# EAGLE design nGeigie_upper_boardV1.00 (EAGLE 7.2.0)
DESIGNER: Rob Oudendijk; VERSION: V1.00
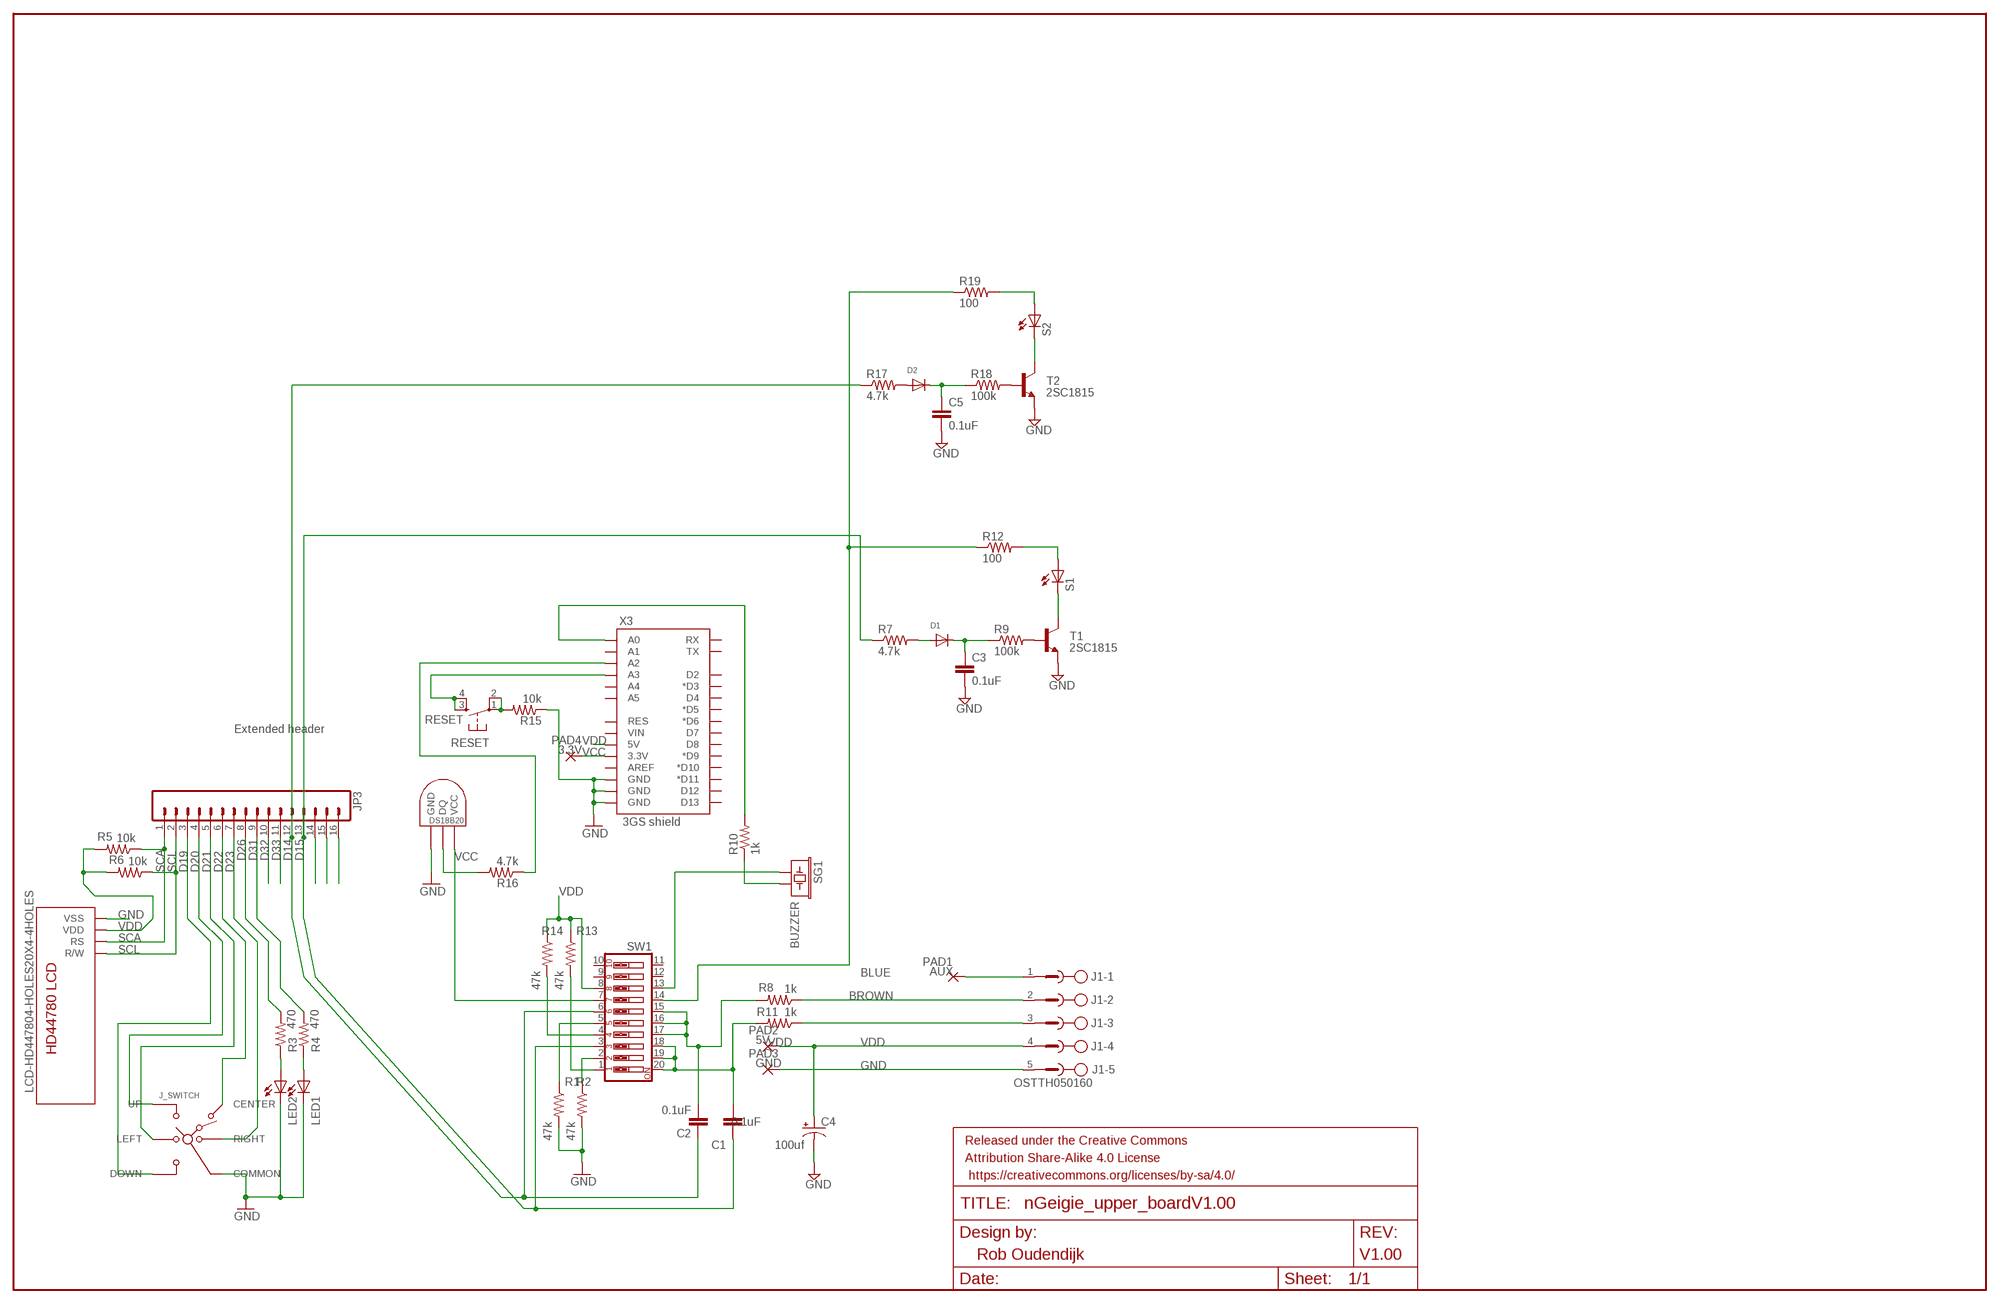
[diagram p0: schematic, sheet 1]

## Parts
C1  0.1uF  C-EU025-024X044  [C025-024X044]
C2  0.1uF  C-EU025-024X044  [C025-024X044]
C3  0.1uF  C-EU025-024X044  [C025-024X044]
C4  100uf  CAP_POLPTH1  [CPOL-RADIAL-100UF-25V]
C5  0.1uF  C-EU025-024X044  [C025-024X044]
D1  DIODEDIODE_BIG  [DO41-10]
D2  DIODEDIODE_BIG  [DO41-10]
FRAME1  FRAME-LEDGER  [CREATIVE_COMMONS]
J1  OSTTH050160  [EDSTL130-05]
J_SWITCH  SKQUCAA010  [SKQU]
JP3  Extended header  M16PTH  [1X16]
LED1  LED3MM  [LED3MM]
LED2  LED3MM  [LED3MM]
PAD1  AUX  2,15/1,0  [2,15/1,0]
PAD2  5V  2,15/1,0  [2,15/1,0]
PAD3  GND  2,15/1,0  [2,15/1,0]
PAD4  3.3V  2,15/1,0  [2,15/1,0]
R1  47k  R-US_0207/10  [0207/10]
R2  47k  R-US_0207/10  [0207/10]
R3  470  R-US_0207/10  [0207/10]
R4  470  R-US_0207/10  [0207/10]
R5  10k  R-US_0207/10  [0207/10]
R6  10k  R-US_0207/10  [0207/10]
R7  4.7k  R-US_0207/10  [0207/10]
R8  1k  R-US_0207/10  [0207/10]
R9  100k  R-US_0207/10  [0207/10]
R10  1k  R-US_0207/10  [0207/10]
R11  1k  R-US_0207/10  [0207/10]
R12  100  R-US_0207/10  [0207/10]
R13  47k  R-US_0207/10  [0207/10]
R14  47k  R-US_0207/10  [0207/10]
R15  10k  R-US_0207/10  [0207/10]
R16  4.7k  R-US_0207/10  [0207/10]
R17  4.7k  R-US_0207/10  [0207/10]
R18  100k  R-US_0207/10  [0207/10]
R19  100  R-US_0207/10  [0207/10]
RESET  RESET  DTS-6  [DTS-6]
S1  LED3MM  [LED3MM]
S2  LED3MM  [LED3MM]
SG1  BUZZER  BUZZERPTH  [BUZZER-12MM]
SW1  SW_DIP-10  [EDG-10]
T1  2SC1815  [TO92-ECB]
T2  2SC1815  [TO92-ECB]
TEMP  AVA_DS1820TO92  [AVA_DS1820]
X1  LCD-HD447804-HOLES20X4-4HOLES  [LCD-20X4-4HOLES]
X3  3GS shield  ARDUINO_SHIELDLABEL  [DUEMILANOVE_SHIELD]

## Nets
BLUE: J1.2 R8.1
BROWN: J1.3 R11.1
D14: C2.1 JP3.12 R17.1 SW1.6
D15: C1.1 JP3.13 R7.1 SW1.3
D19: J_SWITCH.DOWN JP3.3
D20: J_SWITCH.UP JP3.4
D21: J_SWITCH.LEFT JP3.5
D22: J_SWITCH.CENTER JP3.6
D23: J_SWITCH.RIGHT JP3.7
D26: JP3.8 R3.2
D31: JP3.9 R4.2
D32: JP3.10
D33: JP3.11
GND [PWP]: C3.2 C4.1(-) C5.2 J1.5 J_SWITCH.COMMON LED1.K(C) LED2.K(C) PAD3.1(P) R1.2 R2.2 R15.1 T1.E T2.E TEMP.GND X1.P$13(VSS) X3.GND@0(GND) X3.GND@1(GND) X3.GND@2(GND)
N$1: SG1.+ SW1.13
N$2: JP3.14
N$3: LED2.A R3.1
N$4: JP3.15
N$5: R10.2 X3.A0
N$6: R14.2 SW1.4
N$7: R12.1 R19.1 SW1.14
N$8: R2.1 SW1.2
N$9: R1.1 SW1.5
N$10: J1.1 PAD1.1(P)
N$23: R10.1 SG1.-
N$24: R16.2 TEMP.DQ
N$39: C1.2 R11.2 SW1.18 SW1.19 SW1.20
N$40: R16.1 X3.A2
N$43: R13.2 SW1.1
N$54: D1.A R7.2
N$58: C3.1 D1.C R9.1
N$62: LED1.A R4.1
N$76: R9.2 T1.B
N$77: S1.K(C) T1.C
N$84: R15.2 RESET.1 RESET.2
N$85: RESET.3 RESET.4 X3.A3
N$92: R12.2 S1.A
N$136: D2.A R17.2
N$137: C5.1 D2.C R18.1
N$138: R18.2 T2.B
N$139: S2.K(C) T2.C
N$140: R19.2 S2.A
N$223: C2.2 R8.2 SW1.15 SW1.16 SW1.17
N$244: JP3.16
SCA: JP3.1 R5.1 X1.P$15(RS)
SCL: JP3.2 R6.1 X1.P$16(R/W)
VCC [PWP]: PAD4.1(P) SW1.7 TEMP.VDD(VCC) X3.3.3V
VDD [PWP]: C4.2(+) J1.4 PAD2.1(P) R5.2 R6.2 R13.1 R14.1 SW1.8 X1.P$14(VDD) X3.5V
Unconnected: SW1.9 SW1.10 SW1.11 SW1.12 X3.A1 X3.A4 X3.A5 X3.AREF X3.D2 X3.D3(*D3) X3.D4 X3.D5(*D5) X3.D6(*D6) X3.D7 X3.D8 X3.D9(*D9) X3.D10(*D10) X3.D11(*D11) X3.D12 X3.D13 X3.RES X3.RX X3.TX X3.VIN

## Library data of the parts
C1-C3 C5 = rcl:C-EU: CAPACITOR, European symbol
C4 = SparkFun-Capacitors:CAP_POL: Capacitor Polarized These are standard SMD and PTH capacitors. Normally 10uF, 47uF, and 100uF in electrolytic and tantalum varieties. Always verify the external diameter of the through hole cap, it varies with capacity, voltage, and manufacturer. The EIA devices should be standard.
D1 D2 = adafruit:DIODE: Diode SMADIODE - SMA Surface Mount Package 20V 1A Schottky Diode Digikey: 641-1014-6-ND DO-1N4148 - Through Hole Small Current Diode SOD-123 20V 1 A (.5mV Vf) Schottky Diode - Digikey: MBRX120TPMSCT-ND SOD-323 10V 570mA (.38mV Vf, 3ns) Schottky Diode - Digikey: ZLLS410CT-ND SOD-523 30V 30mA Schottky Diode (RB751S-40TE61) - Digikey: RB751S-40TE61CT-ND SOT23-R/W - SOT23 Package (R = Solder Paste/Reflow Ovens, W = Hand-Soldering) BAT54Film 40V 300mA - Digikey: 497-7162-1-ND
FRAME1 = SparkFun-Aesthetics:FRAME-LEDGER: Schematic Frame Standard 11x14 US Ledger frame
J1 = con-ost:OSTTH050160: 5mm Terminal Header
J_SWITCH = joy_switch:SKQU: Multi Control Devices TACT Switch - 4-directional with Center Push Type. SKQU Series.; MF: ALPS; OC_ADAFRUIT: 504; OC_MOUSER: 688-SKQUCA; OC_NEWARK: 59M1983
JP3 = SparkFun-Connectors:M16: 1x16 .1" header
LED1 LED2 S1 S2 = adafruit:LED: LED OSRAM: - CHIPLED LG R971, LG N971, LY N971, LG Q971, LY Q971, LO R971, LY R971 LH N974, LH R974 LS Q976, LO Q976, LY Q976 LO Q996 - Hyper CHIPLED LW Q18S LB Q993, LB Q99A, LB R99A - SideLED LS A670, LO A670, LY A670, LG A670, LP A670 LB A673, LV A673, LT A673, LW A673 LH A674 LY A675 LS A676, LA A676, LO A676, LY A676, LW A676 LS A679, LY A679, LG A679 - Hyper Micro SIDELED® LS Y876, LA Y876, LO Y876, LY Y876 LT Y87S - SmartLED LW L88C, LW L88S LB L89C, LB L89S, LG L890 LS L89K, LO L89K, LY L89K LS L896, LA L896, LO L896, LY L896 - TOPLED LS T670, LO T670, LY T670, LG T670, LP T670 LSG T670, LSP T670, LSY T670, LOP T670, LYG T670 LG T671, LOG T671, LSG T671 LB T673, LV T673, LT T673, LW T673 LH T674 LS T676, LA T676, LO T676, LY T676, LB T676, LH T676, LSB T676, LW T676 LB T67C, LV T67C, LT T67C, LS T67K, LO T67K, LY T67K, LW E67C LS E67B, LA E67B, LO E67B, LY E67B, LB E67C, LV E67C, LT E67C LW T67C LS T679, LY T679, LG T679 LS T770, LO T770, LY T770, LG T770, LP T770 LB T773, LV T773, LT T773, LW T773 LH T774 LS E675, LA E675, LY E675, LS T675 LS T776, LA T776, LO T776, LY T776, LB T776 LHGB T686 LT T68C, LB T68C - Hyper Mini TOPLED® LB M676 - Mini TOPLED Santana® LG M470 LS M47K, LO M47K, LY M47K Source: http://www.osram.convergy.de/
PAD1-PAD4 = wirepad:2,15/1,0: THROUGH-HOLE PAD
R1-R4 R8 R10 R11 R13-R16 = resistor:R-US_: RESISTOR, American symbol
R5 R6 = adafruit:R-US_: RESISTOR, American symbol
R7 R9 R12 R17-R19 = rcl:R-US_: RESISTOR, American symbol
RESET = switch-tact:DTS-6
SG1 = SparkFun:BUZZER: Buzzer 12mm Spark Fun Electronics SKU : Comp-Buzzer
SW1 = special:SW_DIP-10: DIP SWITCH
T1 T2 = transistor:2SC1815: NPN EPITAXIAL TRANSISTOR Source: TOSHIBA .. 2SC1815 1.pdf
TEMP = nGeigie_upper_boardTeensy 3Gshield upper board V0.98:AVA_DS1820: DS18B20 Programmable Resolution 1-Wire Digital Thermometer Description The DS18B20 digital thermometer provides 9-bit to 12-bit Celsius temperature measurements and has an alarm function with nonvolatile user-programmable upper and lower trigger points. The DS18B20 communicates over a 1-Wire® bus that by definition requires only one data line (and ground) for communication with a central microprocessor. It has an operating temperature range of -55°C to +125°C and is accurate to ±0.5°C over the range of -10°C to +85°C. In addition, the DS18B20 can derive power directly from the data line ("parasite power"), eliminating the need for an external power supply. Each DS18B20 has a unique 64-bit serial code, which allows multiple DS18B20s to function on the same 1-Wire bus. Thus, it is simple to use one microprocessor to control many DS18B20s distributed over a large area. Applications that can benefit from this feature include HVAC environmental controls, temperature monitoring systems inside buildings, equipment, or machinery, and process monitoring and control systems.
X1 = LCD204_I2C:LCD-HD44780
X3 = SparkFun-Boards:ARDUINO_SHIELD: Arduino shield footprint

## Net classes
0 default: width 0.406 mm, drill 0.254 mm, clearance 0.305 mm
1 PWP: width 0.813 mm, drill 0.254 mm, clearance 0.305 mm

## Board
nGeigie V2.0 Upper board V1.0.0
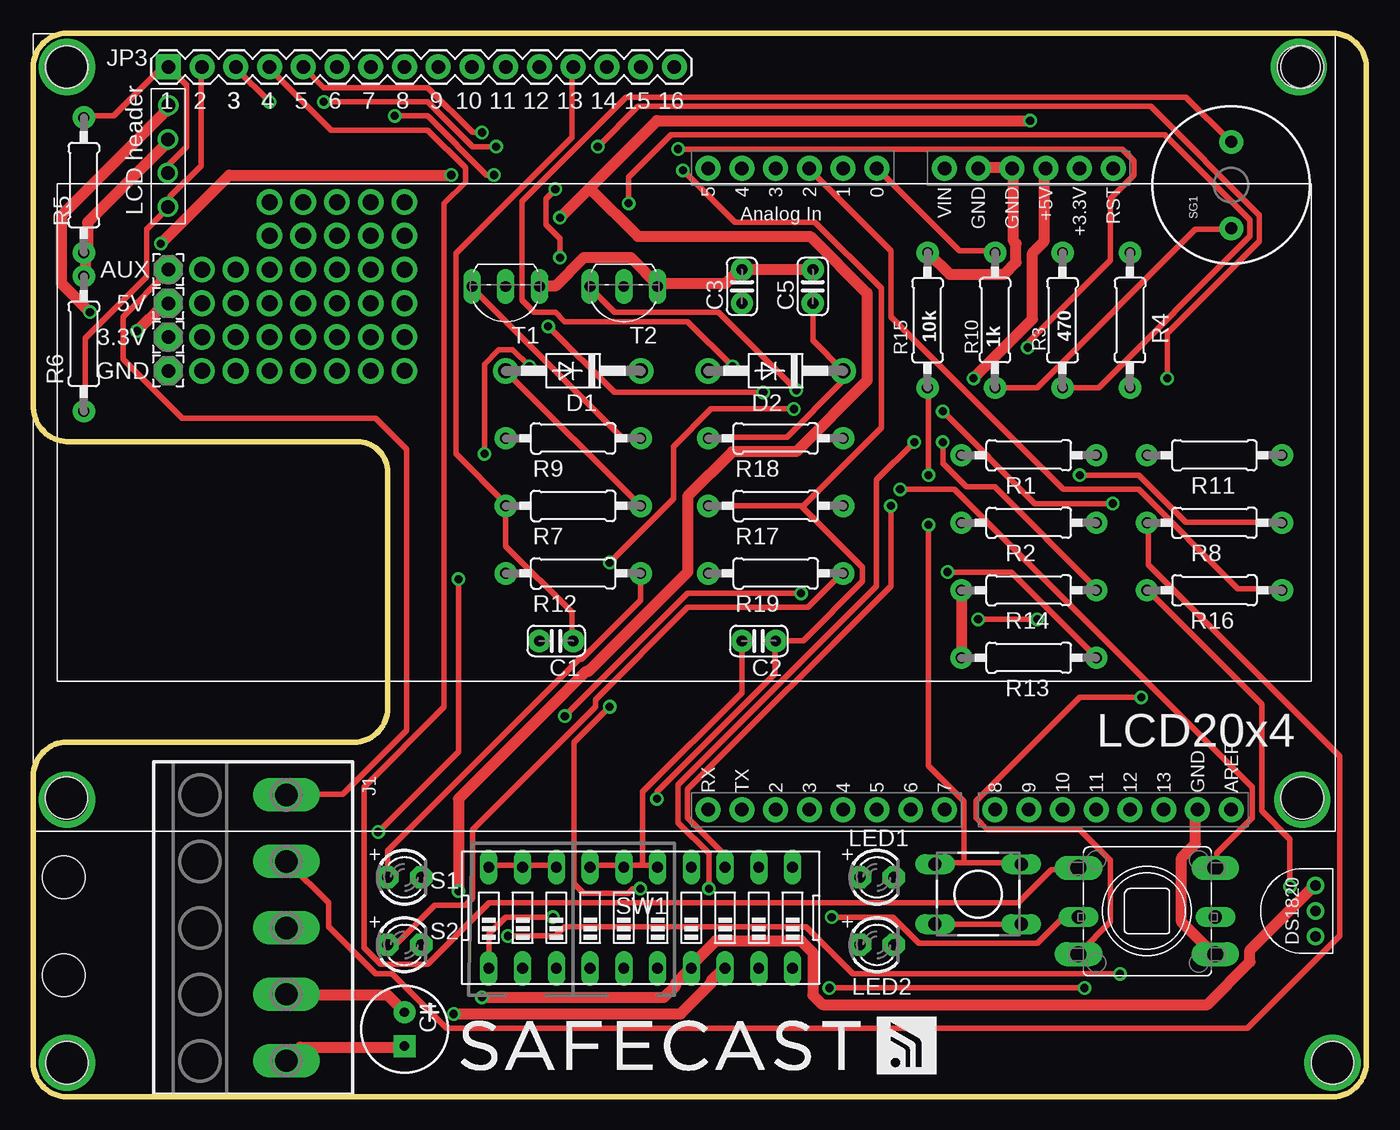
[diagram p1: board, top side]
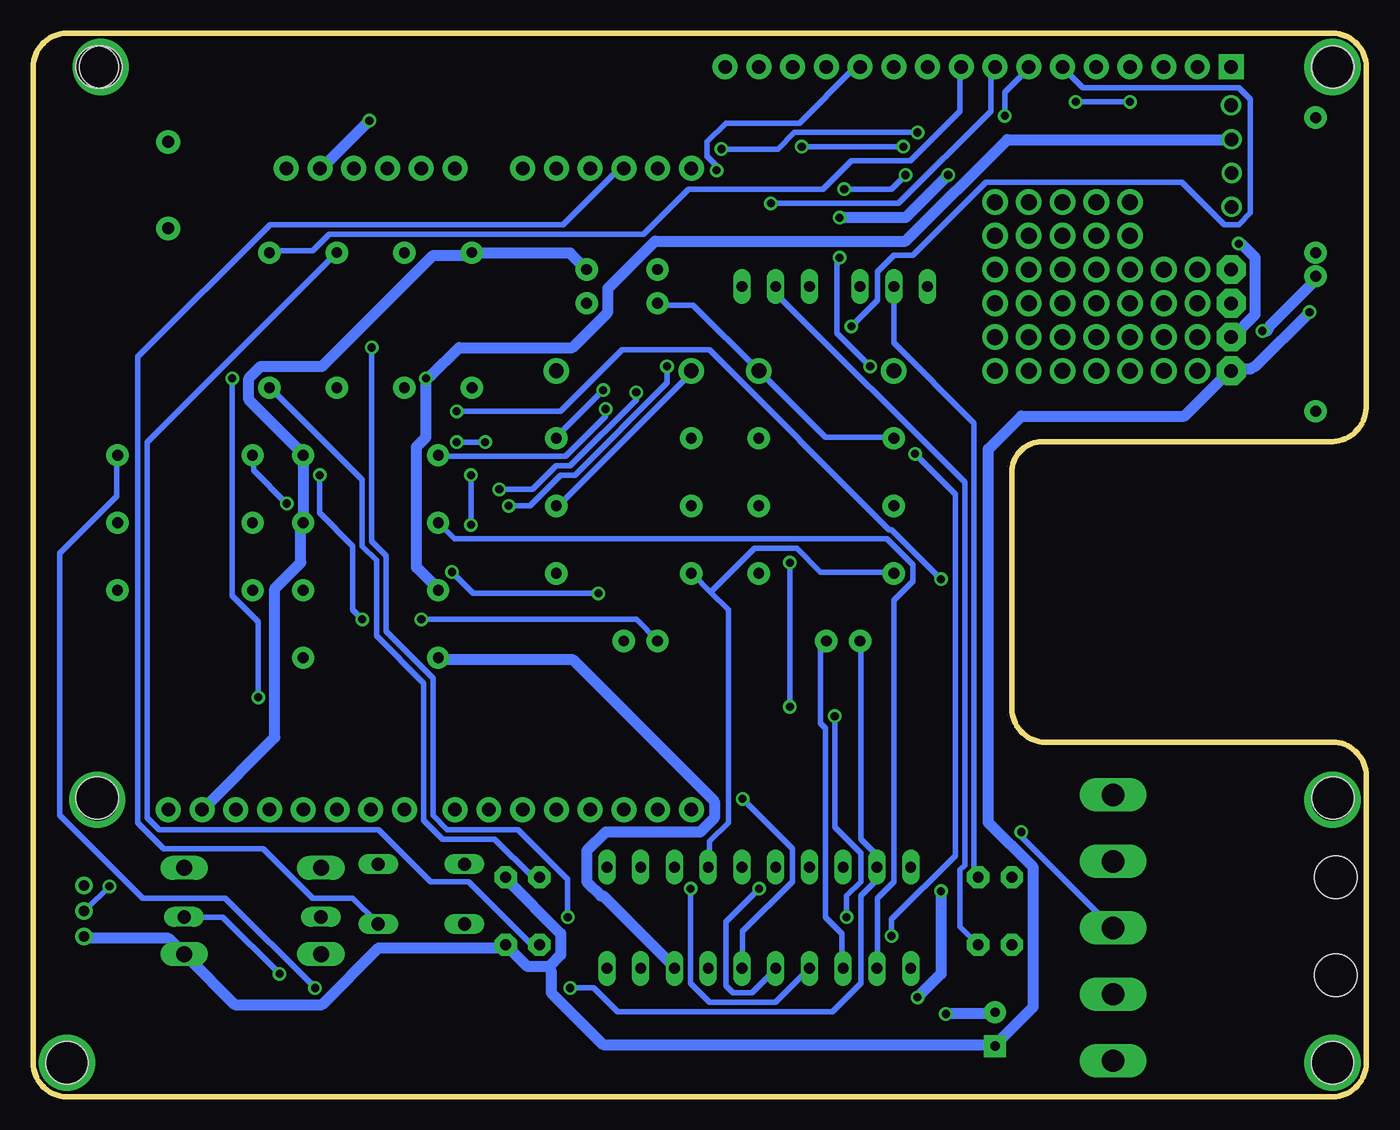
[diagram p2: board, bottom side, seen from below]

Size 100.33 x 80.01 mm. Coordinates in mm from the lower left corner, seen from the top.
Outline: 0,77.47 arc-90 2.54,80.01 97.79,80.01 arc-90 100.33,77.47 100.33,2.54 arc-90 97.79,0 2.54,0 arc-90 0,2.54 0,24.13 arc-90 2.54,26.67 24.13,26.67 arc90 26.67,29.21 26.67,46.99 arc90 24.38,49.28 2.54,49.28 arc-90 0,52.07 0,77.47
Copper layers (1*16): Top 0.035mm / dielectric 1.5mm / Bottom 0.035mm
Design rules "default": minimum track width 10mil, minimum drill 24mil, track to track 8mil, track to pad 8mil, pad to pad 8mil, via to via 8mil, smd to smd 8mil, copper to edge 40mil, drill to drill 8mil, minimum pad ring 10mil, minimum via ring 8mil, stop-mask expansion 4mil, vias tented up to drill 0mil, thermal gap 10mil
Holes 3.2 mm at 2.54,2.54 97.79,2.54 2.54,77.47 95.25,77.47 2.29,9.14 2.29,16.51 2.54,2.54

### Footprints (pad centres in the part's own frame; a part is rotated, then mirrored left to right if it is on the bottom)
C025-024X044 = drill 0.813 pad 1.676: 1 -1.27,0; 2 1.27,0
CPOL-RADIAL-100UF-25V = drill 0.7 pad 1.651 square: 1 -1.27,0 | drill 0.7 pad 1.651: 2 1.27,0
DO41-10 = drill 1.118 pad 1.93: A 5.08,0; C -5.08,0
EDSTL130-05 = drill 1.676 long: 1 -10,0; 2 -5,0; 3 0,0; 4 5,0; 5 10,0
SKQU = drill 1.2 long: CENTER 5.15,3.25; COMMON 5.15,-3.25; DOWN -5.15,-3.25; UP -5.15,3.25 | drill 1 long: LEFT -5.15,-0.45; RIGHT 5.15,-0.45
1X16 = drill 1.016 pad 1.88 square: 1 0,0 | drill 1.016 pad 1.88: 2 2.54,0; 3 5.08,0; 4 7.62,0; 5 10.16,0; 6 12.7,0; 7 15.24,0; 8 17.78,0; 9 20.32,0; 10 22.86,0; 11 25.4,0; 12 27.94,0; 13 30.48,0; 14 33.02,0; 15 35.56,0; 16 38.1,0
LED3MM = drill 0.813 pad 1.676 octagon: A -1.27,0; K 1.27,0
2,15/1,0 = drill 1.016 pad 2.159 octagon: 1 0,0
0207/10 = drill 0.8 pad 1.676: 1 -5.08,0 | drill 0.813 pad 1.676: 2 5.08,0
0207/10' = drill 0.813 pad 1.676: 1 -5.08,0; 2 5.08,0
DTS-6 = drill 1 long: 1 -3.25,2.25; 2 3.25,2.25; 3 -3.25,-2.25; 4 3.25,-2.25
BUZZER-12MM = drill 0.9 pad 1.778: + 3.25,0; - -3.25,0
EDG-10 = drill 0.813 long: 1 -11.43,-3.81; 2 -8.89,-3.81; 3 -6.35,-3.81; 4 -3.81,-3.81; 5 -1.27,-3.81; 6 1.27,-3.81; 7 3.81,-3.81; 8 6.35,-3.81; 9 8.89,-3.81; 10 11.43,-3.81; 11 11.43,3.81; 12 8.89,3.81; 13 6.35,3.81; 14 3.81,3.81; 15 1.27,3.81; 16 -1.27,3.81; 17 -3.81,3.81; 18 -6.35,3.81; 19 -8.89,3.81; 20 -11.43,3.81
TO92-ECB = drill 0.813 long: B 2.54,0; C 0,0; E -2.54,0
AVA_DS1820 = drill 0.8: DQ 2.54,-1.27; GND 0.635,-1.27; VDD 4.445,-1.27
LCD-20X4-4HOLES = drill 1.016: P$13 10.17,54.621; P$14 10.149,52.059; P$15 10.127,49.522; P$16 10.149,46.983 | hole 3.2: 2.5,2.5; 2.5,57.5; 95.5,57.5; 95.5,2.5
DUEMILANOVE_SHIELD = drill 1.016 pad 1.88: 3.3V 12.7,27.94; 5V 10.16,27.94; A0 -2.54,27.94; A1 -5.08,27.94; A2 -7.62,27.94; A3 -10.16,27.94; A4 -12.7,27.94; A5 -15.24,27.94; AREF 24.13,-20.32; D2 -10.16,-20.32; D3 -7.62,-20.32; D4 -5.08,-20.32; D5 -2.54,-20.32; D6 0,-20.32; D7 2.54,-20.32; D8 6.35,-20.32; D9 8.89,-20.32; D10 11.43,-20.32; D11 13.97,-20.32; D12 16.51,-20.32; D13 19.05,-20.32; GND@0 7.62,27.94; GND@1 5.08,27.94; GND@2 21.59,-20.32; RES 15.24,27.94; RX -15.24,-20.32; TX -12.7,-20.32; VIN 2.54,27.94

### Placement (x,y rotation side)
C1  39.37,34.29 180 top
C2  54.61,34.29 180 top
C3  53.34,60.96 90 top
C4  27.94,5.08 90 top
C5  58.67,60.96 90 top
D1  40.64,54.61 180 top
D2  55.88,54.61 180 top
FRAME1  69.85,-3.56 0 top  (outside the outline)
J1  19.05,12.7 270 top
J_SWITCH  83.82,13.97 0 top
JP3  10.16,77.47 0 top
LED1  63.5,16.51 0 top
LED2  63.5,11.43 0 top
PAD1  10.16,62.23 90 top
PAD2  10.16,59.69 90 top
PAD3  10.16,54.61 90 top
PAD4  10.16,57.15 90 top
R1  74.93,48.26 0 top
R2  74.93,43.18 0 top
R3  77.47,58.42 270 top
R4  82.55,58.42 90 top
R5  10k  [0207/10']  3.81,68.58 270 top
R6  10k  [0207/10']  3.81,56.64 90 top
R7  4.7k  [0207/10']  40.64,44.45 0 top
R8  88.9,43.18 0 top
R9  100k  [0207/10']  40.64,49.53 0 top
R10  72.39,58.42 90 top
R11  88.9,48.26 0 top
R12  100  [0207/10']  40.64,39.37 0 top
R13  74.93,33.02 0 top
R14  74.93,38.1 0 top
R15  67.31,58.42 270 top
R16  88.9,38.1 180 top
R17  4.7k  [0207/10']  55.88,44.45 0 top
R18  100k  [0207/10']  55.88,49.53 0 top
R19  100  [0207/10']  55.88,39.37 0 top
RESET  71.12,15.24 0 top
S1  27.94,16.51 0 top
S2  27.94,11.43 0 top
SG1  90.17,68.58 90 top
SW1  45.72,13.46 0 top
T1  35.56,60.96 180 top
T2  44.45,60.96 180 top
TEMP  95.25,11.43 90 top
U$10  [SAFECAST_LOGO1]  31.75,1.27 0 top
X1  0,19.97 0 top
X3  66.04,41.91 0 top

### Tracks (layer width: path | path; a pad name or v marks a point on that pad's centre or on a via)
BLUE
  Top 0.406: R8.1 83.92,43.03 83.92,40.01 98.32,25.6 98.32,12.09 91.39,5.16 31.12,5.16 27.03,9.25 25.78,9.25 22.23,12.8 22.23,14.58 19.2,17.6 J1.2
BROWN  (via drill 0.61)
  Top 0.406: v81.26,44.63 75.39,44.63 v68.45,51.56 | v32,38.94 32,25.96 v25.96,19.91
  Bottom 0.406: v81.26,44.63 83.74,47.12 83.74,48.18 R11.1 | v68.45,51.56 60.63,51.56 56.01,56.19 49.43,56.19 35.92,42.67 35.74,42.67 v32,38.94 | v25.96,19.91 25.96,19.56 19.2,12.8 J1.3
D14  (via drill 0.61)
  Top 0.406: v46.94,22.4 46.94,22.94 55.83,31.83 55.83,34.14 C2.1 56.01,34.31 57.96,34.31 62.41,38.76 62.41,39.83 57.79,44.45 | 57.79,44.45 R17.1 | v48.9,69.7 52.81,65.79 58.85,65.79 63.83,60.81 63.83,50.32 57.96,44.45 57.79,44.45
  Bottom 0.406: v46.94,22.4 43.21,18.67 43.21,16.18 46.94,12.45 46.94,9.78 SW1.6 | v48.9,69.7 48.9,70.05 49.61,70.76 49.61,71.83 48.18,73.25 42.67,73.25 38.58,77.34 38.23,77.34 JP3.12
D15
  Top 0.406: C1.1 40.54,34.31 40.54,36.45 35.56,41.43 R7.1 35.56,44.63 31.83,48.36 31.83,63.48 40.54,72.19 40.54,77.34 JP3.13
  Bottom 0.406: SW1.3 39.47,9.78 39.47,12.27 40.72,13.51 40.72,27.74 41.07,28.09 41.07,33.78 40.72,34.14 C1.1
D19  (via drill 0.61)
  Top 0.406: v83.39,30.05 78.77,30.05 70.94,22.23 70.94,20.98 71.83,20.09 78.77,20.09 81.08,17.78 81.08,13.16 78.77,10.85 J_SWITCH.DOWN | v85.34,54.05 85.34,57.43 92.28,64.36 92.28,66.32 84.1,74.5 45.52,74.5 v42.49,71.48 | v34.85,71.48 33.07,71.48 29.69,74.85 v21.87,74.85 | v17.78,74.85 15.29,77.34 JP3.3
  Bottom 0.406: v83.39,30.05 83.39,35.74 85.34,37.69 v85.34,54.05 | v34.85,71.48 v42.49,71.48 | v17.78,74.85 v21.87,74.85
D20
  Top 0.406: J_SWITCH.UP 78.59,17.07 76.63,17.07 74.14,14.58 34.32,14.58 29.69,9.96 26.14,9.96 24.89,11.2 24.89,23.29 30.94,29.34 30.94,67.21 32.54,68.81 32.54,69.88 29.69,72.72 22.4,72.72 17.78,77.34 JP3.4
D21  (via drill 0.61)
  Top 0.406: v60.1,13.51 64.72,13.51 66.68,11.56 75.57,11.56 77.52,13.51 78.59,13.51 J_SWITCH.LEFT | v74.85,56.36 74.85,56.72 81.08,62.94 81.08,67.56 82.86,69.34 82.86,70.41 81.97,71.3 v48.54,71.3 | v33.78,72.54 33.07,72.54 29.69,75.92 21.87,75.92 JP3.5
  Bottom 0.406: v60.1,13.51 60.1,16.36 63.83,20.09 69.16,20.09 70.23,21.16 70.23,31.47 73.79,35.03 73.79,40.72 74.85,41.78 v74.85,56.36 | v48.54,71.3 44.27,71.3 43.03,72.54 v33.78,72.54
D22  (via drill 0.61)
  Top 0.406: v65.25,45.7 69.34,45.7 91.75,23.29 91.75,20.98 89.08,18.31 89.08,17.25 J_SWITCH.CENTER | v54.94,52.98 43.74,52.98 v38.76,57.96
  Bottom 0.406: v65.25,45.7 62.76,45.7 60.99,47.47 59.92,47.47 54.94,52.45 v54.94,52.98 | v38.76,57.96 36.81,59.92 36.81,62.05 35.56,63.3 34.14,63.3 28.63,68.81 13.87,68.81 10.67,65.61 9.6,65.61 8.71,66.5 8.71,75.03 9.6,75.92 21.34,75.92 22.76,77.34 JP3.6
D23  (via drill 0.61)
  Top 0.406: v81.79,9.25 61.7,9.25 58.14,12.8 40.01,12.8 39.29,12.09 v35.74,12.09 | v33.96,48.36 33.96,55.12 35.03,56.19 36.09,56.19 v37.34,54.94 | v39.65,63.12 39.65,64.54 38.58,65.61 38.58,67.56 v39.29,68.28 | v34.67,69.34 34.14,69.34 29.69,73.79 v27.2,73.79
  Bottom 0.406: v81.79,9.25 86.06,13.51 88.9,13.51 J_SWITCH.RIGHT | v35.74,12.09 35.74,13.34 30.94,18.14 30.94,45.34 v33.96,48.36 | v37.34,54.94 39.83,57.43 39.83,62.94 v39.65,63.12 | v39.29,68.28 35.74,68.28 v34.67,69.34 | v27.2,73.79 27.2,75.56 25.43,77.34 JP3.7
D26  (via drill 0.61)
  Top 0.406: R3.2 80.19,53.34 91.57,64.72 91.57,65.96 85.17,72.36 48.01,72.36 44.81,69.16 v44.81,67.21
  Bottom 0.406: v44.81,67.21 35.2,67.21 28.27,74.14 28.27,77.17 28.09,77.34 JP3.8
D31
  Bottom 0.406: R4.2 82.5,63.65 79.3,63.65 78.05,64.9 54.41,64.9 51.03,68.28 40.89,68.28 38.76,70.41 34.32,70.41 30.58,74.14 30.58,77.34 JP3.9
GND  (via drill 0.61)
  Top 0.813: T1.E 38.23,60.98 39.29,60.98 41.43,63.12 44.98,63.12 47.12,60.98 T2.E 47.47,61.16 52.1,61.16 52.98,62.05 C3.2 C5.2 | X3.GND@1 71.12,69.88 73.61,69.88 X3.GND@0 73.79,69.52 73.79,64.36 73.97,64.19 73.97,62.76 73.08,61.87 68.99,61.87 67.39,63.48 R15.1 | 10.14,74.14 10.14,74.5 X1.P$13 9.78,73.97 2.13,66.32 2.13,61.16 v4.27,59.03 | C4.1 27.92,3.73 20.09,3.73 19.2,2.85 J1.5 | X3.GND@2 87.48,21.51 87.48,19.02 86.41,17.96 86.41,13.16 88.9,10.67 J_SWITCH.COMMON
  Bottom 0.813: C5.2 59.92,63.48 67.21,63.48 R15.1 67.56,63.3 70.23,63.3 78.59,54.94 83.21,54.94 84.1,54.05 84.1,52.45 80.19,48.54 R1.2 R2.2 80.19,42.85 80.19,40.18 82.14,38.23 82.14,27.03 87.48,21.69 X3.GND@2 | 61.52,9.78 63.12,9.78 LED2.K 65.08,11.2 74.32,11.2 78.59,6.93 85.17,6.93 88.72,10.49 J_SWITCH.COMMON 89.08,10.85 90.15,11.91 96.37,11.91 TEMP.GND | 61.52,9.78 60.63,10.67 60.63,12.27 64.72,16.36 LED1.K | 61.52,9.78 61.34,9.42 61.34,7.82 57.43,3.91 28.09,3.91 C4.1 27.74,4.09 25.07,6.76 25.07,17.25 28.45,20.62 28.45,48.72 25.96,51.21 13.69,51.21 10.49,54.41 PAD3.1 10.14,54.76 8.71,54.76 8.36,54.94 v4.27,59.03
N$1  (via drill 0.61)
  Top 0.406: v64.54,44.45 64.54,38.41 49.25,23.11 49.25,20.98 51.92,18.31 51.92,17.42 SW1.13 | v52.63,54.94 49.25,58.32 40.01,58.32 39.29,59.03 37.69,59.03 36.81,59.92 36.81,67.39 44.63,75.21 86.77,75.21 90.15,71.83 SG1.+
  Bottom 0.406: v64.54,44.45 62.94,44.45 60.63,46.76 59.56,46.76 52.63,53.7 v52.63,54.94
N$3
  Bottom 0.406: LED2.A 62.23,11.56 62.94,11.56 67.56,16.18 70.41,16.18 74.32,20.09 90.86,20.09 91.75,20.98 91.75,49.25 77.52,63.48 R3.1
N$5
  Top 0.406: X3.A0 69.7,63.65 72.37,63.65 R10.2
N$6  (via drill 0.61)
  Top 0.406: v50.85,15.65 50.85,18.31 48.54,20.62 48.54,23.47 63.48,38.41 63.48,46.41 v66.32,49.25 | v68.45,49.25 68.45,47.65 70.23,45.87 72.37,45.87 80.01,38.23 R14.2
  Bottom 0.406: SW1.4 44.45,7.11 49.43,7.11 50.85,8.53 v50.85,15.65 | v68.45,49.25 v66.32,49.25
N$7
  Bottom 0.406: 49.34,37.96 50.67,39.29 R19.1 | 49.34,37.96 48.01,36.63 48.01,20.62 49.43,19.2 49.43,17.42 SW1.14 | 49.34,37.96 46.05,41.25 42.85,41.25 41.07,39.47 35.56,39.47 R12.1
N$8
  Bottom 0.406: R2.1 68.63,41.96 36.09,41.96 34.14,40.01 34.14,38.76 35.56,37.34 35.56,16.18 36.81,14.94 36.81,9.78 SW1.2
N$9  (via drill 0.61)
  Top 0.406: v45.7,15.65 45.16,15.65 44.81,15.29 41.43,15.29 40.72,16 40.72,26.67 v43.38,29.34 | v43.38,40.18 48.18,44.98 48.18,48.9 51.03,51.74 v57.25,51.74
  Bottom 0.406: v45.7,15.65 48.18,13.16 48.18,8.36 47.65,7.82 46.23,7.82 44.45,9.6 SW1.5 | v43.38,40.18 v43.38,29.34 | v57.25,51.74 57.25,51.21 60.27,48.18 69.7,48.18 R1.1
N$10
  Top 0.406: 10.14,62.23 PAD1.1 10.14,62.05 6.76,58.67 6.76,55.47 11.2,51.03 25.78,51.03 28.09,48.72 28.09,27.56 23.29,22.76 19.2,22.76 J1.1
N$11  (via drill 1.2 pad 1.93)
  other vias: 25.4,54.61
N$12  (via drill 3.2 pad 3.81)
  other vias: 2.54,77.47
N$13  (via drill 3.2 pad 3.81)
  other vias: 95.25,77.47
N$14  (via drill 1.2 pad 1.93)
  other vias: 25.4,57.15
N$15  (via drill 1.2 pad 1.93)
  other vias: 27.94,57.15
N$16  (via drill 1.2 pad 1.93)
  other vias: 27.94,54.61
N$17  (via drill 3.2 pad 3.81)
  other vias: 97.79,2.54
N$18  (via drill 3.2 pad 3.81)
  other vias: 2.54,22.35
N$19  (via drill 1.2 pad 1.93)
  other vias: 25.4,62.23
N$20  (via drill 3.2 pad 3.81)
  other vias: 2.54,2.54
N$21  (via drill 3.2 pad 3.81)
  other vias: 95.5,22.35
N$22  (via drill 1.2 pad 1.93)
  other vias: 20.32,67.31
N$23
  Top 0.406: R10.1 75.57,53.34 87.48,65.25 90.15,65.25 SG1.-
N$24  (via drill 0.61)
  Top 0.406: v94.59,15.82 94.59,19.38 92.46,21.51 92.46,29.52 83.92,38.05 R16.2
  Bottom 0.406: v94.59,15.82 96.37,14.05 TEMP.DQ
N$25  (via drill 1.2 pad 1.93)
  other vias: 20.32,64.77
N$27  (via drill 1.2 pad 1.93)
  other vias: 17.78,64.77
N$31  (via drill 1.2 pad 1.93)
  other vias: 17.78,67.31
N$33  (via drill 1.2 pad 1.93)
  other vias: 25.4,59.69
N$34  (via drill 1.2 pad 1.93)
  other vias: 27.94,59.69
N$35  (via drill 1.2 pad 1.93)
  other vias: 27.94,62.23
N$38  (via drill 1.2 pad 1.93)
  other vias: 25.4,67.31
N$39  (via drill 0.61)
  Top 0.406: SW1.20 34.32,17.42 36.81,17.42 SW1.19 36.98,17.42 39.29,17.42 SW1.18 | v59.92,8.18 v79.12,8.18
  Bottom 0.406: C1.2 38.05,34.14 38.05,19.38 36.98,18.31 36.98,17.42 SW1.19 36.98,17.25 36.98,16.18 38.05,15.11 38.05,8.53 40.18,6.4 56.36,6.4 58.14,8.18 v59.92,8.18 | v79.12,8.18 85.88,14.94 92.1,14.94 98.32,21.16 98.32,40.89 94.06,45.16 94.06,48.18 R11.2
N$40
  Top 0.406: R16.1 93.88,38.23 90.68,38.23 83.21,45.7 77.52,45.7 64.54,58.67 64.54,63.65 58.5,69.7 X3.A2
N$41  (via drill 1.2 pad 1.93)
  other vias: 25.4,64.77
N$43  (via drill 0.61)
  Top 0.406: v39.12,13.51 35.56,13.51 34.32,12.27 34.32,9.78 SW1.1 | v40.01,28.63 49.25,37.87 v57.79,37.87 | v68.81,39.47 73.61,39.47 80.01,33.07 R13.2
  Bottom 0.406: v39.12,13.51 39.12,15.11 38.05,16.18 38.05,18.31 40.01,20.27 v40.01,28.63 | v57.79,37.87 67.21,37.87 v68.81,39.47
N$44  (via drill 1.2 pad 1.93)
  other vias: 22.86,64.77
N$46  (via drill 1.2 pad 1.93)
  other vias: 20.32,54.61
N$47  (via drill 1.2 pad 1.93)
  other vias: 20.32,57.15
N$48  (via drill 1.2 pad 1.93)
  other vias: 22.86,57.15
N$49  (via drill 1.2 pad 1.93)
  other vias: 22.86,54.61
N$50  (via drill 1.2 pad 1.93)
  other vias: 22.86,67.31
N$51  (via drill 1.2 pad 1.93)
  other vias: 27.94,64.77
N$53  (via drill 1.2 pad 1.93)
  other vias: 27.94,67.31
N$54
  Top 0.406: R7.2 45.7,44.45 35.56,54.59 D1.A
N$56  (via drill 1.2 pad 1.93)
  other vias: 20.32,62.23
N$58
  Bottom 0.406: R9.1 35.56,49.61 40.72,49.61 D1.C 50.67,59.56 53.34,59.56 C3.1
N$62
  Bottom 0.406: LED1.A 62.23,16.54 62.76,16.54 65.61,19.38 69.52,19.38 70.94,20.8 70.94,31.11 74.5,34.67 74.5,40.36 75.57,41.43 75.57,46.41 82.5,53.34 R4.1
N$75  (via drill 1.2 pad 1.93)
  other vias: 12.7,57.15
N$76
  Top 0.406: T1.B 33.07,60.81 44.27,49.61 45.7,49.61 R9.2
N$77
  Bottom 0.406: T1.C 35.56,56.72 29.52,50.67 29.52,16.71 29.34,16.54 S1.K
N$80  (via drill 1.2 pad 1.93)
  other vias: 17.78,54.61
N$82  (via drill 1.2 pad 1.93)
  other vias: 12.7,59.69
N$83  (via drill 1.2 pad 1.93)
  other vias: 15.24,59.69
N$84  (via drill 0.61)
  Top 0.406: 70.05,17.6 74.32,17.6 RESET.2 | 70.05,17.6 67.92,17.6 RESET.1 | v67.39,46.76 67.39,53.34 R15.2 | v67.39,43.03 67.39,24.89 70.05,22.23 70.05,17.6
  Bottom 0.406: v67.39,43.03 v67.39,46.76
N$85
  Top 0.406: RESET.3 67.92,12.98 74.32,12.98 RESET.4
  Bottom 0.406: X3.A3 56.01,69.7 56.36,69.7 60.45,65.61 82.5,65.61 92.46,55.65 92.46,20.62 90.5,18.67 83.03,18.67 79.3,14.94 76.28,14.94 74.5,13.16 RESET.4
N$86  (via drill 1.2 pad 1.93)
  other vias: 15.24,57.15
N$87  (via drill 1.2 pad 1.93)
  other vias: 17.78,59.69
N$92
  Top 0.406: S1.A 26.67,18.49 41.07,32.89 41.25,32.89 45.7,37.34 45.7,39.29 R12.2
N$106  (via drill 1.2 pad 1.93)
  other vias: 17.78,57.15
N$109  (via drill 1.2 pad 1.93)
  other vias: 15.24,54.61
N$111  (via drill 1.2 pad 1.93)
  other vias: 12.7,54.61
N$112  (via drill 1.2 pad 1.93)
  other vias: 20.32,59.69
N$113  (via drill 1.2 pad 1.93)
  other vias: 22.86,59.69
N$136
  Bottom 0.406: R17.2 60.81,44.45 50.67,54.59 D2.A
N$137
  Top 0.406: R18.1 50.85,49.61 56.72,49.61 60.81,53.7 60.81,54.59 D2.C 58.67,56.9 C5.1
N$138  (via drill 0.61)
  Top 0.406: v57.43,53.16 51.56,59.03 43.74,59.03 41.96,60.81 T2.B
  Bottom 0.406: v57.43,53.16 60.99,49.61 R18.2
N$139
  Bottom 0.406: T2.C 44.45,60.45 30.23,46.23 30.23,17.42 30.58,17.07 30.58,12.8 S2.K
N$140
  Top 0.406: S2.A 26.67,11.56 27.38,11.56 30.23,14.4 32.54,14.4 33.07,14.94 33.07,20.09 42.32,29.34 42.32,29.87 49.25,36.8 58.32,36.8 60.81,39.29 R19.2
N$212  (via drill 1.2 pad 1.93)
  other vias: 17.78,62.23
N$213  (via drill 1.2 pad 1.93)
  other vias: 15.24,62.23
N$214  (via drill 1.2 pad 1.93)
  other vias: 12.7,62.23
N$222  (via drill 1.2 pad 1.93)
  other vias: 22.86,62.23
N$223  (via drill 0.61)
  Top 0.406: SW1.17 41.96,17.42 44.45,17.42 SW1.16 44.63,17.42 45.87,17.42 | 45.87,17.42 46.94,17.42 SW1.15 | C2.2 53.34,30.4 45.87,22.94 45.87,17.42 | v78.77,46.76 83.21,46.76 86.77,43.2 93.88,43.2 R8.2 | v71.12,35.92 v75.57,35.92
  Bottom 0.406: v78.77,46.76 78.77,43.92 76.28,41.43 76.28,36.63 v75.57,35.92 | v71.12,35.92 54.94,35.92 53.34,34.31 C2.2
SCA
  Top 0.406: X1.P$15 10.14,69.52 10.14,70.05 11.56,71.48 11.56,76.1 10.31,77.34 JP3.1 | 9.96,77.52 JP3.1 | R5.1 3.91,73.79 6.05,73.79 9.78,77.52 JP3.1
SCL
  Top 0.406: JP3.2 12.62,77.34 12.62,70.05 10.31,67.74 10.31,67.03 X1.P$16 10.14,66.85 8.53,65.25 8.53,61.7 3.91,57.07 3.91,51.56 R6.1
VCC  (via drill 0.61)
  Top 0.813: TEMP.VDD 96.37,15.82 91.57,11.02 91.57,10.13 88.37,6.93 59.39,6.93 58.67,7.64 58.67,10.85 57.79,11.73 51.38,11.73 49.43,9.78 SW1.7 49.25,9.42 48.36,8.53 48.36,8.36 47.47,7.47 v33.78,7.47 | v75.03,73.43 46.94,73.43 41.87,68.36 | v39.65,66.14 41.87,68.36 | v31.47,69.34 14.76,69.34 v9.6,64.19 | v32,15.47 32,22.4 41.61,32 41.78,32 49.25,39.47 49.25,45.16 52.63,48.54 57.43,48.54 62.76,53.87 62.76,60.45 58.5,64.72 45.52,64.72 41.87,68.36
  Bottom 0.813: v75.03,73.43 78.59,69.88 X3.3.3V | v39.65,66.14 34.67,66.14 v31.47,69.34 | v9.6,64.19 9.42,64.19 8.36,63.12 8.36,58.85 10.14,57.07 PAD4.1 | v33.78,7.47 32,9.25 v32,15.47
VDD  (via drill 0.61)
  Top 0.813: v31.65,6.22 48.72,6.22 51.03,8.53 51.03,8.71 51.92,9.6 SW1.8 | J1.4 19.2,7.64 26.67,7.64 27.92,6.4 C4.2 | 10.14,71.65 10.14,72.01 X1.P$14 9.78,71.48 4.09,65.79 4.09,63.83 R5.2 3.91,63.48 3.91,61.87 R6.2 | v7.82,57.61 9.78,59.56 10.14,59.56 PAD2.1 | R13.1 69.88,33.07 69.88,38.05 R14.1 | v70.76,54.05 75.21,58.5 75.21,63.48 76.1,64.36 76.1,69.7 X3.5V
  Bottom 0.813: v31.65,6.22 28.09,6.22 C4.2 | v7.82,57.61 7.47,57.61 7.29,57.96 3.91,61.34 3.91,61.7 R6.2 | R14.1 69.88,38.23 71.48,39.83 71.48,48.9 70.76,49.61 v70.76,54.05 70.41,54.23 68.28,56.36 59.74,56.36 57.07,59.03 57.07,60.81 53.52,64.36 34.67,64.36 27.03,72.01 10.31,72.01 X1.P$14 | SW1.8 52.1,9.78 57.43,15.11 57.61,15.11 58.67,16.18 58.67,18.49 57.25,19.91 50.14,19.91 49.07,20.98 49.07,22.23 59.74,32.89 69.7,32.89 R13.1

### Text on the board
tDocu: Thanks to Shuttleworth Foundation, Medcom / and many Safecast volunteers | AUX | BLU | S1 | BRN | S2 | WHT | S1 | S2 | Vcc | nGeigieKit V2.0 | BLK | GND